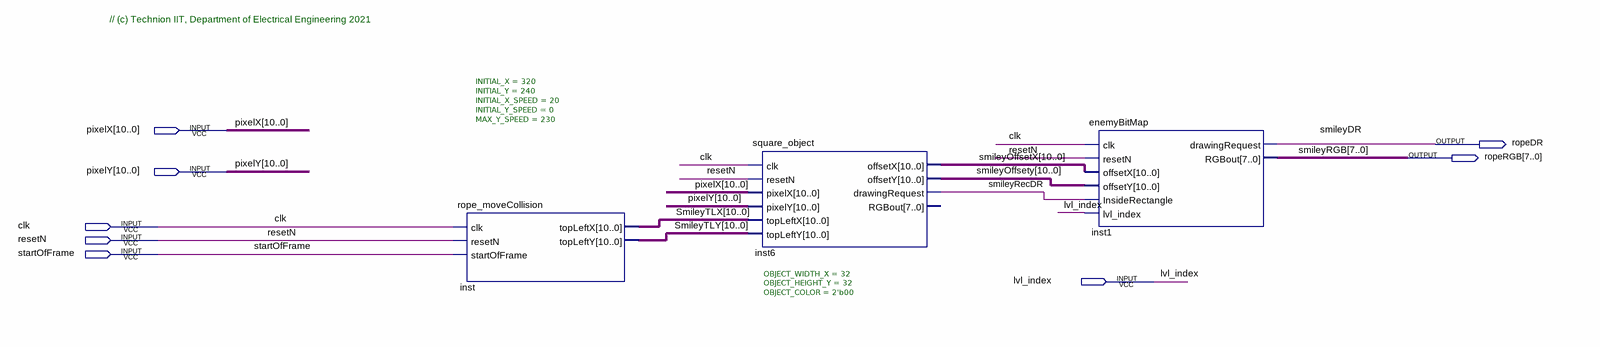
[diagram p0: schematic sheet]
// Quartus schematic Enemy_Block.bdf as structural Verilog: 3 symbols, 8 pins
module Enemy_Block (
  input  [10:0] pixelX,
  input  [10:0] pixelY,
  input  clk,
  input  resetN,
  input  startOfFrame,
  input  lvl_index,
  output ropeDR,
  output [7:0] ropeRGB
);

  wire smileyRecDR;
  wire [10:0] smileyOffsetX, smileyOffsety, SmileyTLX, SmileyTLY;

  rope_moveCollision #(.INITIAL_X(320), .INITIAL_Y(240), .INITIAL_X_SPEED(20), .INITIAL_Y_SPEED(0), .MAX_Y_SPEED(230)) inst (
    .clk(clk), .resetN(resetN), .startOfFrame(startOfFrame), .topLeftX(SmileyTLX), .topLeftY(SmileyTLY));
  square_object #(.OBJECT_WIDTH_X(32), .OBJECT_HEIGHT_Y(32), .OBJECT_COLOR(2'b00)) inst6 (
    .clk(clk), .resetN(resetN), .pixelX(pixelX), .pixelY(pixelY), .topLeftX(SmileyTLX), .topLeftY(SmileyTLY),
    .offsetX(smileyOffsetX), .offsetY(smileyOffsety), .drawingRequest(smileyRecDR));  // open: RGBout
  enemyBitMap inst1 (
    .clk(clk), .resetN(resetN), .offsetX(smileyOffsetX), .offsetY(smileyOffsety),
    .InsideRectangle(smileyRecDR), .lvl_index(lvl_index), .drawingRequest(ropeDR), .RGBout(ropeRGB));

  // Other names for the same wires on the sheet: smileyDR = ropeDR; smileyRGB[7:0] = ropeRGB

  // Notes on the sheet:
  //   // (c) Technion IIT, Department of Electrical Engineering 2021
endmodule
